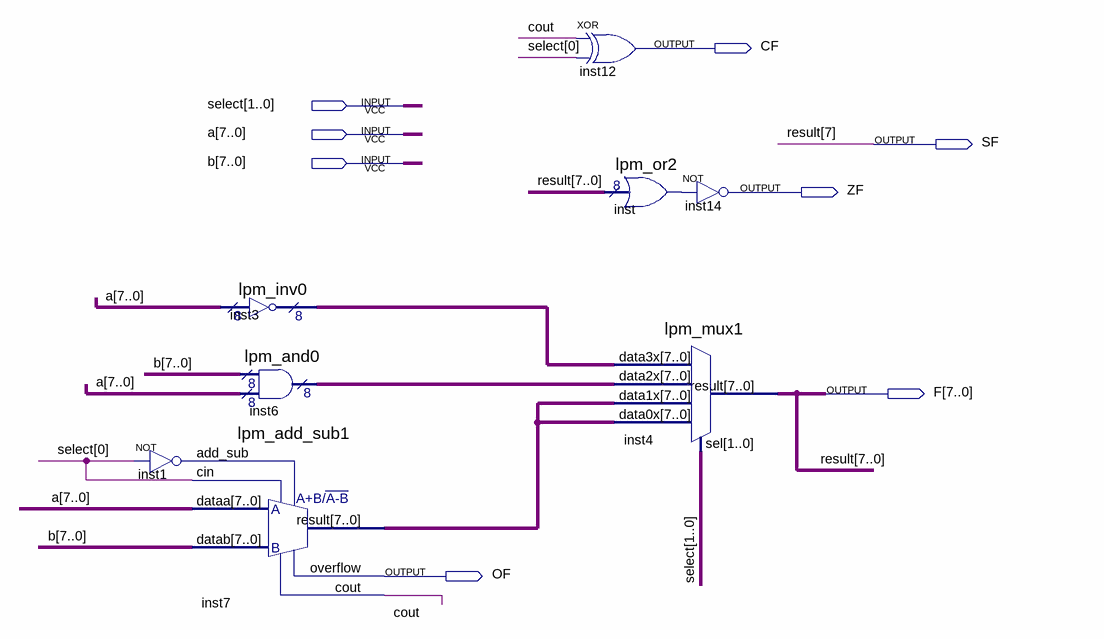
[diagram p0: schematic sheet]
// Quartus schematic ALU.bdf as structural Verilog: 8 symbols, 8 pins
module ALU (
  input  [1:0] select,
  input  [7:0] a,
  input  [7:0] b,
  output CF,
  output SF,
  output ZF,
  output [7:0] F,
  output OF
);

  wire cout, inst1_out, inst_result;
  wire [7:0] inst3_result, inst6_result, inst7_result;

  not inst1 (inst1_out, select[0]);
  lpm_inv0 inst3 (.data(a), .result(inst3_result));
  lpm_add_sub1 inst7 (
    .dataa(a), .datab(b), .add_sub(inst1_out), .cin(select[0]), .result(inst7_result), .overflow(OF),
    .cout(cout));
  lpm_and0 inst6 (.data0x(b), .data1x(a), .result(inst6_result));
  xor inst12 (CF, cout, select[0]);
  lpm_or2 inst (.data(F), .result(inst_result));
  not inst14 (ZF, inst_result);
  lpm_mux1 inst4 (
    .data3x(inst3_result), .data2x(inst6_result), .data1x(inst7_result), .data0x(inst7_result), .sel(select),
    .result(F));

  assign SF = F[7];

  // Other names for the same wires on the sheet: result[7:0] = F
endmodule
